# Altium schematic sheet karmanDB_pyro.SchDoc
size A
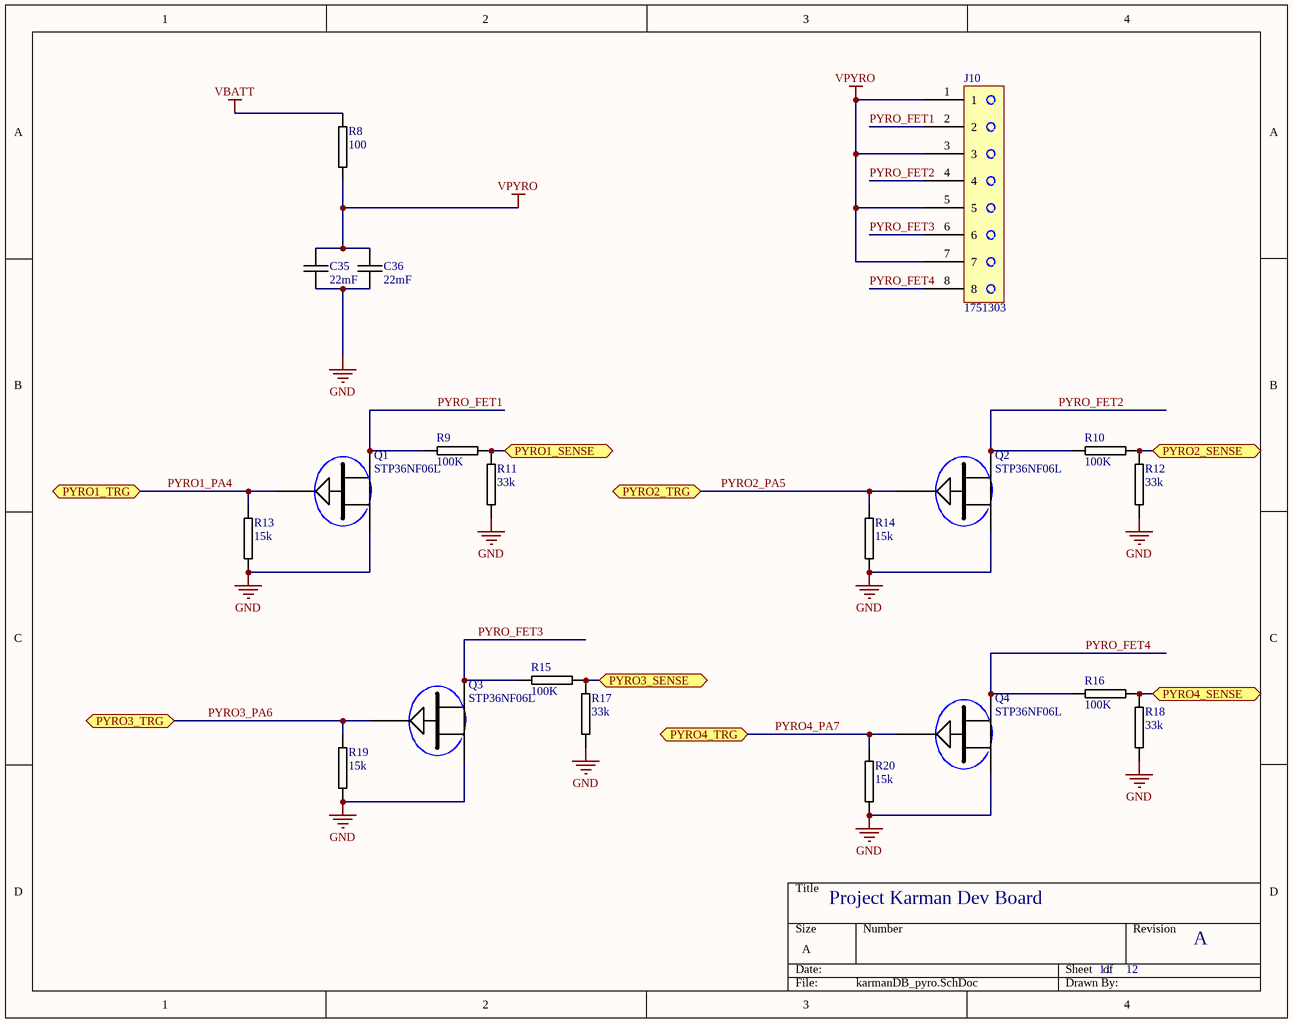
[diagram p0: karmanDB_pyro.SchDoc]

## Parts
C35  22mF  [AVX_BZ01]
C36  22mF  [AVX_BZ01]
J10  1751303  [1751303]
Q1  STP36NF06L  [ST(P/B)36NF06L]
Q2  STP36NF06L  [ST(P/B)36NF06L]
Q3  STP36NF06L  [ST(P/B)36NF06L]
Q4  STP36NF06L  [ST(P/B)36NF06L]
R8  100  [PANASONIC_ERJ1T]
R9  100K  [PANASONIC_ERJ3R]
R10  100K  [PANASONIC_ERJ3R]
R11  33k  [PANASONIC_ERJ2R_SERIES]
R12  33k  [PANASONIC_ERJ2R_SERIES]
R13  15k  [PANASONIC_ERJ3R]
R14  15k  [PANASONIC_ERJ3R]
R15  100K  [PANASONIC_ERJ3R]
R16  100K  [PANASONIC_ERJ3R]
R17  33k  [PANASONIC_ERJ2R_SERIES]
R18  33k  [PANASONIC_ERJ2R_SERIES]
R19  15k  [PANASONIC_ERJ3R]
R20  15k  [PANASONIC_ERJ3R]

## Ports
PYRO1_SENSE (bidir), PYRO1_TRG (bidir), PYRO2_SENSE (bidir), PYRO2_TRG (bidir), PYRO3_SENSE (bidir), PYRO3_TRG (bidir), PYRO4_SENSE (bidir), PYRO4_TRG (bidir)

## Nets
GND: C35.2 C36.2 Q1.3(S) Q2.3(S) Q3.3(S) Q4.3(S) R11.2 R12.2 R13.2 R14.2 R17.2 R18.2 R19.2 R20.2
VBATT: R8.1
VPYRO: C35.1 C36.1 J10.1 J10.3 J10.5 J10.7 R8.2
PYRO1_PA4: Q1.1(G) R13.1 ; port PYRO1_TRG
PYRO1_SENSE: R9.2 R11.1 ; port PYRO1_SENSE
PYRO2_PA5: Q2.1(G) R14.1 ; port PYRO2_TRG
PYRO2_SENSE: R10.2 R12.1 ; port PYRO2_SENSE
PYRO3_PA6: Q3.1(G) R19.1 ; port PYRO3_TRG
PYRO3_SENSE: R15.2 R17.1 ; port PYRO3_SENSE
PYRO4_PA7: Q4.1(G) R20.1 ; port PYRO4_TRG
PYRO4_SENSE: R16.2 R18.1 ; port PYRO4_SENSE
PYRO_FET1: J10.2 Q1.2(D) R9.1
PYRO_FET2: J10.4 Q2.2(D) R10.1
PYRO_FET3: J10.6 Q3.2(D) R15.1
PYRO_FET4: J10.8 Q4.2(D) R16.1

## Notes on the sheet
- Project Karman Dev Board
- 11
- 12
- A

## Library data of the parts
C35 C36 = BZ01CA223ZSB: CAP 22MF -20% +80% 12V SMD; Manufacturer: AVX Corporation; Tolerance: -20%, +80%; ESR (Equivalent Series Resistance): 350 mOhm; Lifetime @ Temp.: 1000 Hrs @ 70°C; Supplier 1: Digi-Key; Manufacturer Part Number: BZ01CA223ZSB; RoHS: RoHS Compliant; Category: Capacitors; Stock 1: 220; Pricing 1: 1=15, 10=14.25, 100=11.25, 250=10.5, 500=9.975, 1000=9.375, 5000=9 (USD); Packaging: Tray; Capacitance: 22mF; Voltage - Rated: 12V; Termination: Solder Pads; Mounting Type: Surface Mount; Package / Case: BZ01, 3 Lead; Lead Spacing: -; Size / Dimension: 1.102" L x 0.669" W (28.00mm x 17.00mm); Height - Seated (Max): 0.299" (7.60mm); Operating Temperature: -20°C ~ 70°C; ComponentLink1URL: http://www.avx.com/docs/catalogs/bestcap.pdf; ComponentLink1Description: http://www.avx.com/docs/catalogs/bestcap.pdf; Supplier Part Number 1: 478-3523-ND
J10 = 1751303: CONN TERM BLOCK 8POS 3.5MM; Manufacturer: Phoenix Contact; Number of Levels: 1; Positions Per Level: 8; Pitch: 0.138" (3.50mm); Mating Orientation: Horizontal with Board; Current: 10A; Voltage: 300V; Wire Gauge: 16-30 AWG; Wire Termination: Screw - Rising Cage Clamp; Torque - Screw: 0.22-0.25 Nm (1.9-2.2 Lb-In); Screw Thread: M2; Supplier 1: Digi-Key; Manufacturer Part Number: 1751303; RoHS: RoHS Compliant; Category: Connectors, Interconnects; Stock 1: 1222; Pricing 1: 1=4.43, 10=4.241, 50=4.1254, 100=3.8556, 250=3.54716, 500=3.27726, 1000=3.06181, 2500=2.8728 (USD); Packaging: Bulk; Mounting Type: Through Hole; Features: -; Color: Green; Operating Temperature: -; Housing Material: Polyamide (PA), Nylon; Contact Material - Plating: -; Clamp Material - Plating: -; Screw Material - Plating: -; ComponentLink1URL: http://media.digikey.com/PDF/Data%20Sheets/Phoenix%20Contact%20PDFs/1751303.pdf; ComponentLink1Description: http://media.digikey.com/PDF/Data%20Sheets/Phoenix%20Contact%20PDFs/1751303.pdf; Supplier Part Number 1: 277-5792-ND
Q1-Q4 = STP36NF06L: MOSFET N-CH 60V 30A TO-220; Manufacturer: STMicroelectronics; FET Type: MOSFET N-Channel, Metal Oxide; FET Feature: Standard; Current - Continuous Drain (Id) @ 25°C: 30A (Tc); Rds On (Max) @ Id, Vgs: 40 mOhm @ 15A, 10V; Vgs(th) (Max) @ Id: 2.5V @ 250µA; Gate Charge (Qg) @ Vgs: 17nC @ 5V; Input Capacitance (Ciss) @ Vds: 660pF @ 25V; Power - Max: 70W; Supplier 1: Digi-Key; Manufacturer Part Number: STP36NF06L; RoHS: RoHS Compliant; Category: Discrete Semiconductor Products; Stock 1: 547; Pricing 1: 1=1.1, 10=0.851, 100=0.677, 500=0.618, 1000=0.472, 2500=0.419, 10000=0.403, 25000=0.39375 (USD); Packaging: Tube; Drain to Source Voltage (Vdss): 60V; Mounting Type: Through Hole; Package / Case: TO-220-3; Supplier Device Package: TO-220AB; ComponentLink1URL: http://www.st.com/web/en/resource/technical/document/datasheet/CD00003405.pdf; ComponentLink1Description: http://www.st.com/web/en/resource/technical/document/datasheet/CD00003405.pdf; Supplier Part Number 1: 497-7522-5-ND
R8 = RES_PANASONIC_ERJ-1TYJ101U: RES SMD 100 OHM 5% 1W 2512; Supplier 1: Digi-Key; Supplier Part Number 1: PT100XTR-ND
R9 R10 R15 R16 = RES_PANASONIC_ERJ-3GEYJ104V: RES SMD 100K OHM 5% 1/10W 0603; Manufacturer: Panasonic Electronic Components; Power (Watts): 0.1W, 1/10W; Temperature Coefficient: ±200ppm/°C; Supplier 1: Digi-Key; Supplier Part Number 1: P100KGCT-ND; Manufacturer Part Number: ERJ-3GEYJ104V; RoHS: RoHS Compliant; Category: Resistors; Stock 1: 1746081; Pricing: 1=0.1, 50=0.0096, 100=0.0071, 250=0.00544, 500=0.00436, 1000=0.00321 (USD); Packaging: Cut Tape (CT); Resistance (Ohms): 100k; Tolerance: ±5%; Composition: Thick Film; Features: Automotive AEC-Q200; Operating Temperature: -55°C ~ 155°C; Package / Case: 0603 (1608 Metric); Supplier Device Package: 0603; Size / Dimension: 0.063" L x 0.031" W (1.60mm x 0.80mm); Height: 0.022" (0.55mm); Number of Terminations: 2; ComponentLink1URL: http://industrial.panasonic.com/www-cgi/jvcr13pz.cgi?E+PZ+3+AOA0001+ERJ3GEYJ104V+7+WW; ComponentLink1Description: http://industrial.panasonic.com/www-cgi/jvcr13pz.cgi?E+PZ+3+AOA0001+ERJ3GEYJ104V+7+WW
R11 R12 R17 R18 = RES_PANASONIC_ERJ-2GEJ333X: RES SMD 33K OHM 5% 1/10W 0402; Manufacturer: Panasonic Electronic Components; Power (Watts): 0.1W, 1/10W; Temperature Coefficient: ±200ppm/°C; Supplier 1: Digi-Key; Manufacturer Part Number: ERJ-2GEJ333X; RoHS: RoHS Compliant; Category: Resistors; Stock 1: 860000; Pricing 1: 10000=0.00198, 30000=0.00174, 50000=0.0016, 100000=0.00156 (USD); Packaging: Tape & Reel (TR); Resistance (Ohms): 33k; Tolerance: ±5%; Composition: Thick Film; Features: Automotive AEC-Q200; Operating Temperature: -55°C ~ 155°C; Package / Case: 0402 (1005 Metric); Supplier Device Package: 0402; Size / Dimension: 0.039" L x 0.020" W (1.00mm x 0.50mm); Height: 0.016" (0.40mm); Number of Terminations: 2; ComponentLink1URL: http://industrial.panasonic.com/www-cgi/jvcr13pz.cgi?E+PZ+3+AOA0001+ERJ2GEJ333X+7+WW; ComponentLink1Description: http://industrial.panasonic.com/www-cgi/jvcr13pz.cgi?E+PZ+3+AOA0001+ERJ2GEJ333X+7+WW; Supplier Part Number 1: P33KJTR-ND
R13 R14 R19 R20 = RES_PAN_ERA-3AED153V: RES SMD 15K OHM 0.5% 1/10W 0603; Manufacturer: Panasonic Electronic Components; Power (Watts): 0.1W, 1/10W; Temperature Coefficient: ±25ppm/°C; Supplier 1: Digi-Key; Manufacturer Part Number: ERA-3AED153V; RoHS: RoHS Compliant; Category: Resistors; Stock 1: 5000; Pricing 1: 5000=0.01558, 10000=0.01353, 25000=0.01189, 50000=0.01091, 125000=0.01068 (USD); Packaging: Tape & Reel (TR); Resistance (Ohms): 15k; Tolerance: ±0.5%; Composition: Thin Film; Features: Automotive AEC-Q200; Operating Temperature: -55°C ~ 155°C; Package / Case: 0603 (1608 Metric); Supplier Device Package: 0603; Size / Dimension: 0.063" L x 0.031" W (1.60mm x 0.80mm); Height: 0.022" (0.55mm); Number of Terminations: 2; ComponentLink1URL: http://industrial.panasonic.com/lecs/www-data/pdf/AOA0000/AOA0000CE26.pdf; ComponentLink1Description: http://industrial.panasonic.com/lecs/www-data/pdf/AOA0000/AOA0000CE26.pdf; Supplier Part Number 1: P15KBLTR-ND